# EAGLE design EEPROM-protowiring (EAGLE 7.6.0)
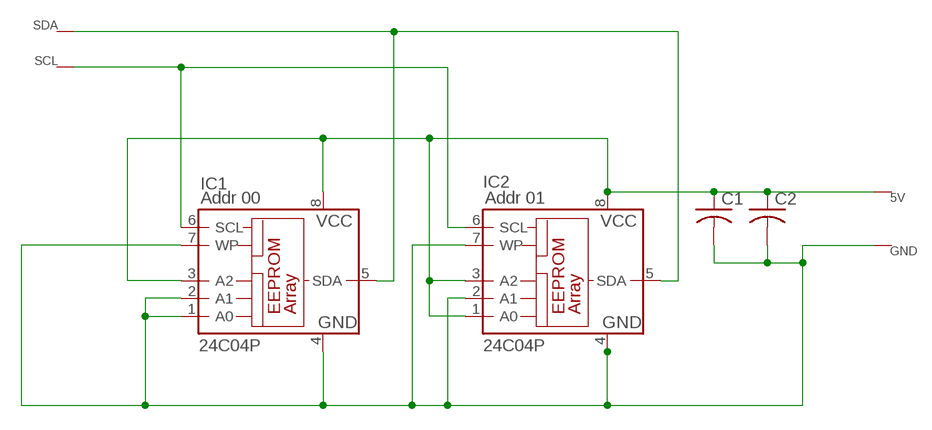
[diagram p0: schematic, sheet 1]

## Parts
5V  WIRE-VIA8  [VIA8]
C1  C-US-2.5MM  [C025-025X050]
C2  C-US-2.5MM  [C025-025X050]
GND  WIRE-VIA8  [VIA8]
IC1  24C04P  [DIL8]
IC2  24C04P  [DIL8]
SCL  WIRE-VIA8  [VIA8]
SDA  WIRE-VIA8  [VIA8]

## Nets
5V: 5V.P$1 C1.1 C2.1 IC1.3(A2) IC1.8(VCC) IC2.1(A0) IC2.3(A2) IC2.8(VCC)
GND: C1.2 C2.2 GND.P$1 IC1.1(A0) IC1.2(A1) IC1.4(GND) IC1.7(WP) IC2.2(A1) IC2.4(GND) IC2.7(WP)
N$3: IC1.6(SCL) IC2.6(SCL) SCL.P$1
N$4: IC1.5(SDA) IC2.5(SDA) SDA.P$1

## Notes on the sheet
- Addr 00 | Addr 01

## Library data of the parts
5V GND SCL SDA = mylib4:WIRE: Pad for a wire offboard
C1 C2 = my-rcl:C-US: CAPACITOR, American symbol
IC1 IC2 = microchip:24C*: Serial EEPROM 1 K/2 K/4 K; MPN: M24C04-WBN6P; OC_FARNELL: 1094258; OC_NEWARK: 02M5802

## Net classes
0 default: width 0.6 mm
1 power: width 1 mm

## Board
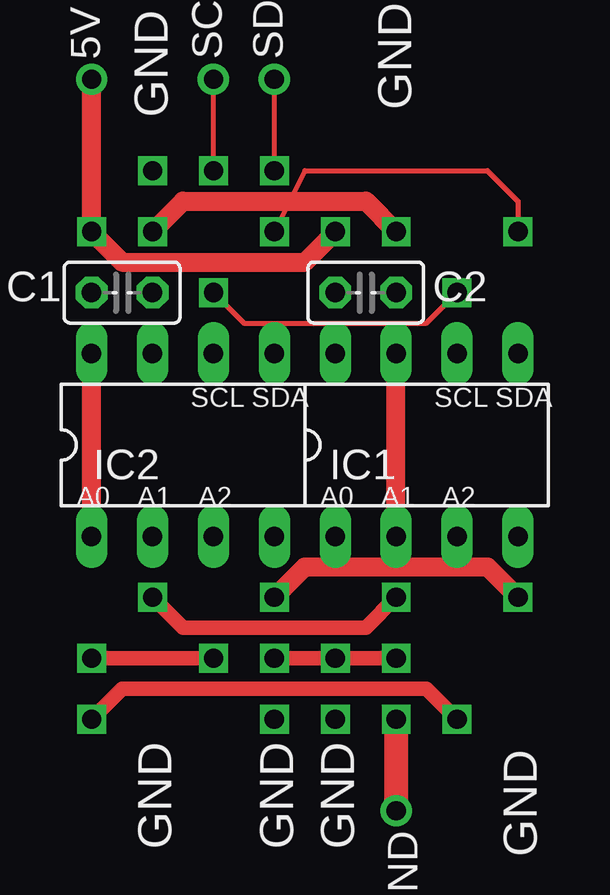
[diagram p1: board, top side]
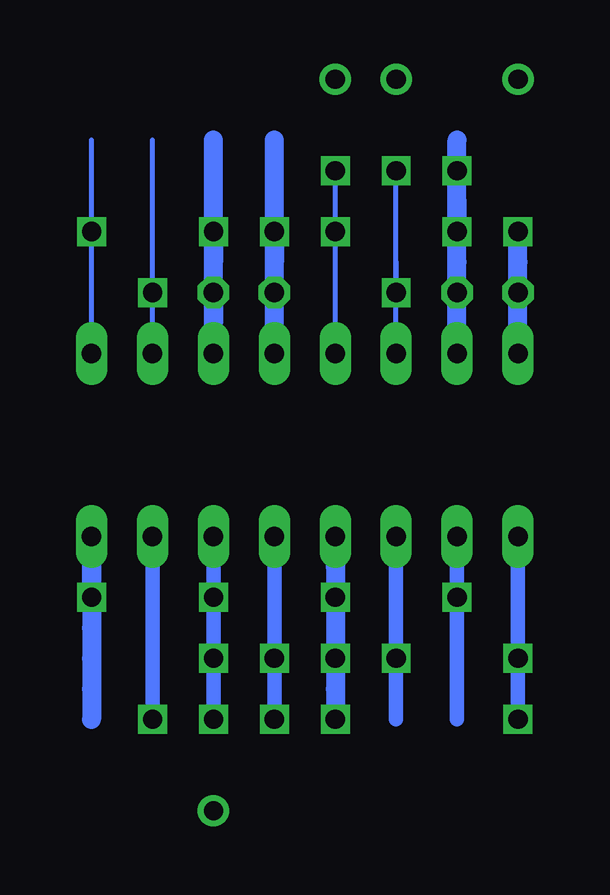
[diagram p2: board, bottom side, seen from below]

No outline drawn. Coordinates in mm, seen from the top.
Copper layers (1*16): Top 0.035mm / dielectric 1.5mm / Bottom 0.035mm
Design rules "default *": minimum track width 10mil, minimum drill 24mil, track to track 8mil, track to pad 8mil, pad to pad 8mil, via to via 8mil, smd to smd 8mil, copper to edge 40mil, drill to drill 8mil, minimum pad ring 10mil, minimum via ring 8mil, stop-mask expansion 4mil, vias tented up to drill 0mil, thermal gap 10mil

### Footprints (pad centres in the part's own frame; a part is rotated, then mirrored left to right if it is on the bottom)
VIA8 = drill 0.8: P$1 0,0
C025-025X050 = drill 0.813 octagon: 1 -1.27,0; 2 1.27,0
DIL8 = drill 0.813 long: 1 -3.81,-3.81; 2 -1.27,-3.81; 3 1.27,-3.81; 4 3.81,-3.81; 5 3.81,3.81; 6 1.27,3.81; 7 -1.27,3.81; 8 -3.81,3.81

### Placement (x,y rotation side)
5V  10.16,33.02 90 top
C1  11.43,24.13 0 top
C2  21.59,24.13 0 top
GND  22.86,2.54 270 top
IC1  24.13,17.78 0 top
IC2  13.97,17.78 0 top
SCL  15.24,33.02 90 top
SDA  17.78,33.02 90 top

### Tracks (layer width: path | path; a pad name or v marks a point on that pad's centre or on a via)
5V  (via drill 0.8)
  Top 0.6: v10.16,8.89 v15.24,8.89 | v10.16,6.35 11.43,7.62 24.13,7.62 v25.4,6.35
  Top 0.8: 5V.P$1 v10.16,26.67 11.43,25.4 19.05,25.4 v20.32,26.67 | IC2.1 IC2.8
  Bottom 0.6: v10.16,8.89 v10.16,6.35 v10.16,8.89 | v15.24,8.89 15.24,10.16 IC2.3 | v15.24,8.89 15.24,6.35 v15.24,8.89 | 25.4,7.62 25.4,10.16 IC1.3 | 25.4,7.62 v25.4,6.35 25.4,7.62 | v10.16,8.89 IC2.1
  Bottom 0.8: IC2.8 C1.1 | C1.1 10.16,25.4 | 10.16,25.4 v10.16,26.67 | IC1.8 C2.1 | C2.1 20.32,25.4 | 20.32,25.4 v20.32,26.67 | v20.32,26.67 20.32,30.48 | v20.32,26.67 20.32,25.4 | C1.1 10.16,25.4 | C2.1 20.32,25.4
GND  (via drill 0.8)
  Top 0.6: v22.86,8.89 v20.32,8.89 v17.78,8.89 | v12.7,11.43 13.97,10.16 21.59,10.16 v22.86,11.43
  Top 0.8: v12.7,26.67 13.97,27.94 21.59,27.94 v22.86,26.67 | v17.78,11.43 19.05,12.7 26.67,12.7 v27.94,11.43 | IC1.2 IC1.7
  Top 1: v22.86,6.35 GND.P$1
  Bottom 0.6: IC2.2 12.7,12.7 | 12.7,12.7 v12.7,11.43 | v12.7,11.43 12.7,8.89 | 12.7,8.89 12.7,7.62 | 12.7,7.62 12.7,6.35 | 20.32,12.7 IC1.1 20.32,10.16 | 20.32,10.16 v20.32,8.89 | v20.32,8.89 v20.32,6.35 | IC1.2 22.86,12.7 v22.86,11.43 22.86,10.16 v22.86,8.89 | v22.86,8.89 22.86,7.62 | 22.86,7.62 v22.86,6.35 | v22.86,8.89 22.86,7.62 | v20.32,8.89 20.32,10.16 | v12.7,11.43 12.7,12.7 | 12.7,8.89 12.7,7.62
  Bottom 0.8: IC2.7 C1.2 | C1.2 12.7,25.4 | 12.7,25.4 v12.7,26.67 | v12.7,26.67 12.7,27.94 | 12.7,27.94 v12.7,26.67 | v12.7,26.67 12.7,27.94 | 12.7,27.94 v12.7,29.21 12.7,30.48 | IC1.7 22.86,22.86 | 22.86,22.86 C2.2 | C2.2 22.86,25.4 | 22.86,25.4 v22.86,26.67 | v22.86,26.67 22.86,30.48 v22.86,26.67 | 17.78,12.7 IC2.4 17.78,12.7 | 17.78,12.7 v17.78,11.43 | v17.78,11.43 v17.78,8.89 | v17.78,8.89 17.78,7.62 | 17.78,7.62 v17.78,6.35 | IC1.4 27.94,12.7 | 27.94,12.7 v27.94,11.43 | v27.94,11.43 27.94,10.16 | 27.94,10.16 27.94,8.89 27.94,7.62 27.94,6.35 | v12.7,26.67 12.7,27.94 | C1.2 12.7,25.4 | v12.7,26.67 12.7,27.94 | v22.86,26.67 22.86,25.4 | C2.2 22.86,22.86 | v27.94,11.43 27.94,12.7 | v27.94,11.43 27.94,10.16 | v17.78,8.89 17.78,7.62 | 17.78,12.7 v17.78,11.43
N$3  (via drill 0.8)
  Top 0.2: v15.24,29.21 SCL.P$1 | v15.24,24.13 16.51,22.86 24.13,22.86 v25.4,24.13
  Bottom 0.2: IC2.6 15.24,25.4 v15.24,24.13 v15.24,29.21 | IC1.6 25.4,22.86 | 25.4,22.86 v25.4,24.13 | v25.4,24.13 25.4,30.48 | 25.4,22.86 v25.4,24.13
N$4  (via drill 0.8)
  Top 0.2: v17.78,29.21 17.78,30.48 SDA.P$1 | v17.78,26.67 19.05,29.21 26.67,29.21 27.94,27.94 v27.94,26.67
  Bottom 0.2: IC2.5 v17.78,26.67 v17.78,29.21 | IC1.5 v27.94,26.67 27.94,30.48

### Text on the board
tPlace: GND | GND | SCL | SDA | SCL | SDA | A0 | A1 | A2 | A0 | A1 | A2 | GND | GND | GND | GND